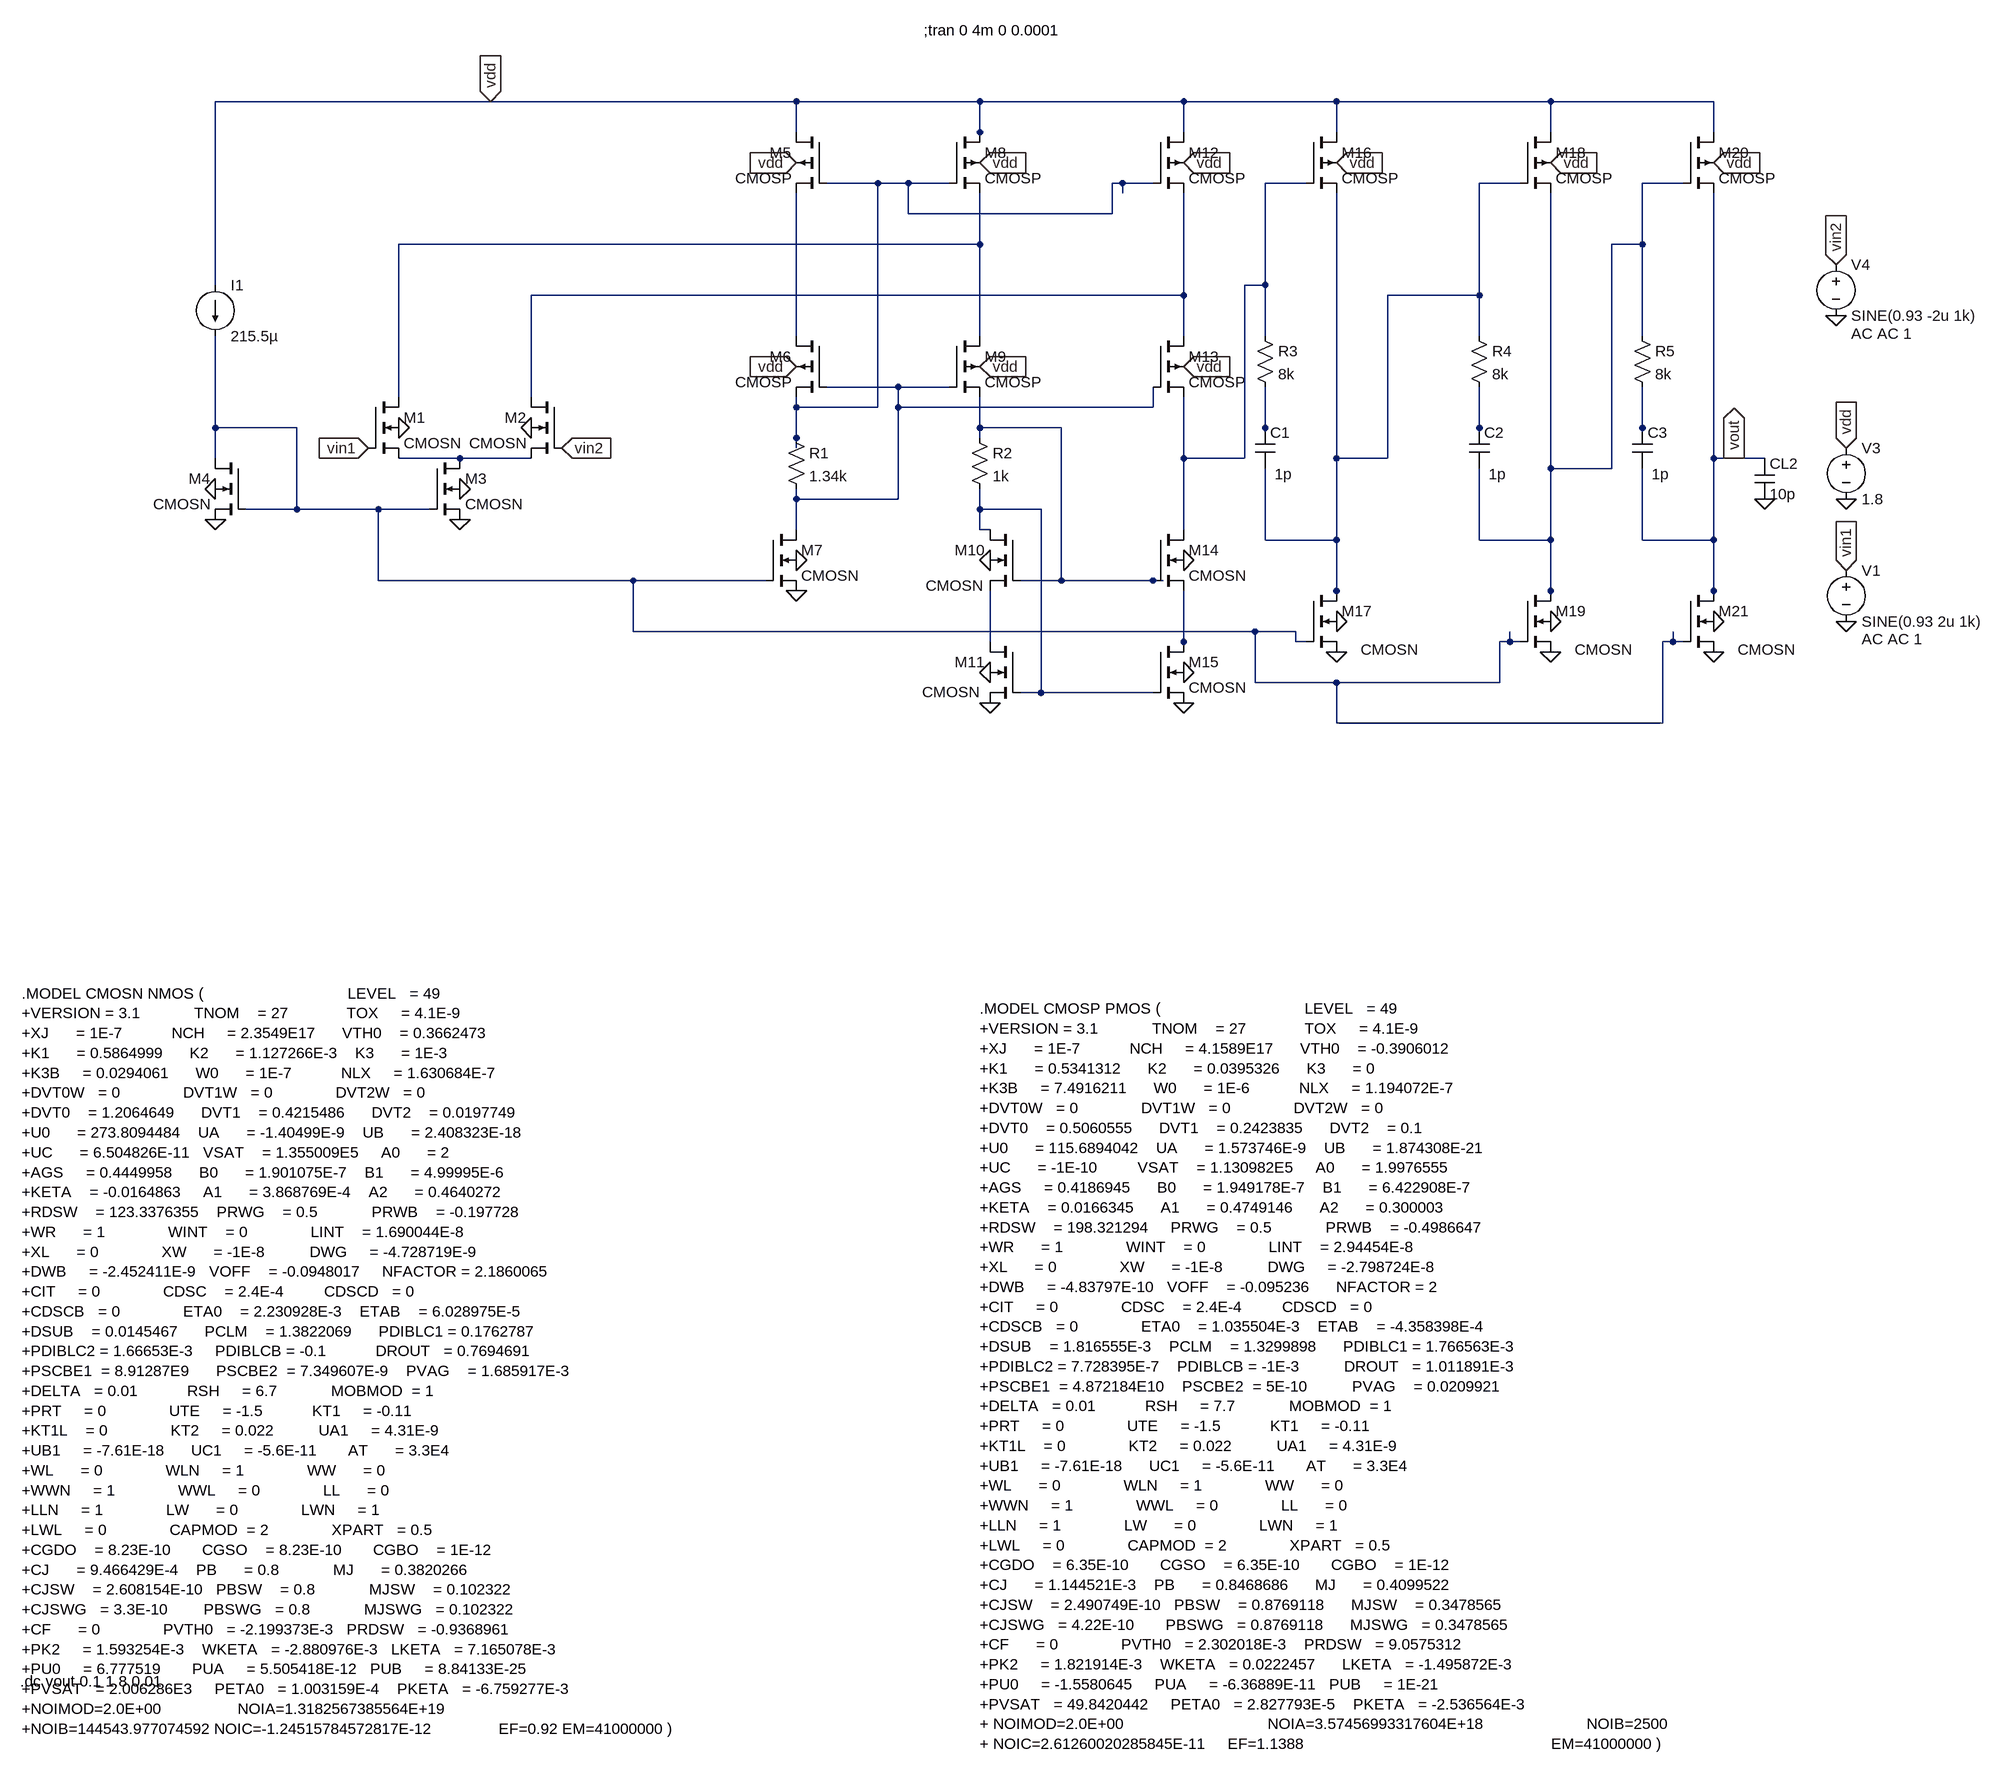
[diagram p0: schematic 4stage_fc.asc]
4stage_fc.asc, the LTspice schematic file:
Version 4
SHEET 1 1808 1648
WIRE -960 -848 -1392 -848
WIRE -480 -848 -960 -848
WIRE -192 -848 -480 -848
WIRE 128 -848 -192 -848
WIRE 368 -848 128 -848
WIRE 704 -848 368 -848
WIRE 960 -848 704 -848
WIRE -480 -800 -480 -848
WIRE -192 -800 -192 -848
WIRE 128 -800 128 -848
WIRE 368 -800 368 -848
WIRE 704 -800 704 -848
WIRE 960 -800 960 -848
WIRE -192 -784 -192 -800
WIRE -352 -720 -432 -720
WIRE -304 -720 -352 -720
WIRE -240 -720 -304 -720
WIRE 32 -720 16 -720
WIRE 80 -720 32 -720
WIRE 320 -720 256 -720
WIRE 656 -720 592 -720
WIRE 912 -720 848 -720
WIRE 32 -704 32 -720
WIRE -304 -672 -304 -720
WIRE 16 -672 16 -720
WIRE 16 -672 -304 -672
WIRE -192 -624 -192 -704
WIRE -192 -624 -1104 -624
WIRE 848 -624 848 -720
WIRE 848 -624 800 -624
WIRE -1392 -560 -1392 -848
WIRE 256 -560 256 -720
WIRE 256 -560 224 -560
WIRE 128 -544 128 -704
WIRE 128 -544 -896 -544
WIRE 592 -544 592 -720
WIRE 592 -544 448 -544
WIRE -480 -480 -480 -704
WIRE -192 -480 -192 -624
WIRE 128 -480 128 -544
WIRE 256 -480 256 -560
WIRE 592 -480 592 -544
WIRE 848 -480 848 -624
WIRE -320 -400 -432 -400
WIRE -240 -400 -320 -400
WIRE -1104 -384 -1104 -624
WIRE -896 -384 -896 -544
WIRE -480 -368 -480 -384
WIRE -352 -368 -352 -720
WIRE -352 -368 -480 -368
WIRE -320 -368 -320 -400
WIRE 80 -368 80 -400
WIRE 80 -368 -320 -368
WIRE -1392 -336 -1392 -480
WIRE -1264 -336 -1392 -336
WIRE -192 -336 -192 -384
WIRE -64 -336 -192 -336
WIRE 256 -336 256 -400
WIRE 592 -336 592 -400
WIRE 848 -336 848 -400
WIRE -480 -320 -480 -368
WIRE -192 -320 -192 -336
WIRE 256 -320 256 -336
WIRE 592 -320 592 -336
WIRE 848 -320 848 -336
WIRE -480 -304 -480 -320
WIRE -1392 -288 -1392 -336
WIRE -1008 -288 -1104 -288
WIRE -896 -288 -1008 -288
WIRE 128 -288 128 -384
WIRE 224 -288 224 -560
WIRE 224 -288 128 -288
WIRE 368 -288 368 -704
WIRE 448 -288 448 -544
WIRE 448 -288 368 -288
WIRE 960 -288 960 -704
WIRE 992 -288 960 -288
WIRE 1040 -288 992 -288
WIRE 704 -272 704 -704
WIRE 800 -272 800 -624
WIRE 800 -272 704 -272
WIRE -480 -224 -480 -240
WIRE -320 -224 -320 -368
WIRE -320 -224 -480 -224
WIRE -1264 -208 -1264 -336
WIRE -1264 -208 -1344 -208
WIRE -1136 -208 -1264 -208
WIRE -1056 -208 -1136 -208
WIRE -192 -208 -192 -240
WIRE -96 -208 -192 -208
WIRE -480 -176 -480 -224
WIRE -192 -176 -192 -208
WIRE -176 -176 -192 -176
WIRE 128 -176 128 -288
WIRE 256 -160 256 -272
WIRE 368 -160 368 -288
WIRE 368 -160 256 -160
WIRE 592 -160 592 -272
WIRE 704 -160 704 -272
WIRE 704 -160 592 -160
WIRE 848 -160 848 -272
WIRE 960 -160 960 -288
WIRE 960 -160 848 -160
WIRE -1136 -96 -1136 -208
WIRE -736 -96 -1136 -96
WIRE -528 -96 -736 -96
WIRE -64 -96 -64 -336
WIRE -64 -96 -128 -96
WIRE 80 -96 -64 -96
WIRE 96 -96 80 -96
WIRE 368 -80 368 -160
WIRE 704 -80 704 -160
WIRE 960 -80 960 -160
WIRE 368 -64 368 -80
WIRE 704 -64 704 -80
WIRE 960 -64 960 -80
WIRE -736 -16 -736 -96
WIRE 240 -16 -736 -16
WIRE 304 -16 240 -16
WIRE -176 0 -176 -80
WIRE 128 0 128 -80
WIRE 304 0 304 -16
WIRE 320 0 304 0
WIRE 640 0 640 -16
WIRE 640 0 624 0
WIRE 656 0 640 0
WIRE 896 0 896 -16
WIRE 896 0 880 0
WIRE 912 0 896 0
WIRE 128 16 128 0
WIRE 240 64 240 -16
WIRE 368 64 240 64
WIRE 624 64 624 0
WIRE 624 64 368 64
WIRE -96 80 -96 -208
WIRE -96 80 -128 80
WIRE 80 80 -96 80
WIRE 368 128 368 64
WIRE 880 128 880 0
WIRE 880 128 368 128
FLAG -1008 -192 0
FLAG -1008 -240 0
FLAG -1104 -336 0
FLAG -896 -336 0
FLAG -1152 -304 vin1
IOPIN -1152 -304 In
FLAG -848 -304 vin2
IOPIN -848 -304 In
FLAG 1168 -112 vin1
IOPIN 1168 -112 In
FLAG 1168 -32 0
FLAG 1168 -304 vdd
IOPIN 1168 -304 In
FLAG 1168 -224 0
FLAG -1392 -192 0
FLAG -1392 -240 0
FLAG -480 -752 vdd
IOPIN -480 -752 In
FLAG -480 -432 vdd
IOPIN -480 -432 In
FLAG -480 -80 0
FLAG -480 -128 0
FLAG -176 -128 0
FLAG -176 96 0
FLAG -176 48 0
FLAG -192 -432 vdd
IOPIN -192 -432 In
FLAG -192 -752 vdd
IOPIN -192 -752 In
FLAG 128 96 0
FLAG 128 48 0
FLAG 368 -32 0
FLAG 368 16 0
FLAG 128 -128 0
FLAG 128 -432 vdd
IOPIN 128 -432 In
FLAG 128 -752 vdd
IOPIN 128 -752 In
FLAG 368 -752 vdd
IOPIN 368 -752 In
FLAG -960 -848 vdd
IOPIN -960 -848 In
FLAG 704 -32 0
FLAG 704 16 0
FLAG 704 -752 vdd
IOPIN 704 -752 In
FLAG 960 -32 0
FLAG 960 16 0
FLAG 960 -752 vdd
IOPIN 960 -752 In
FLAG 1040 -224 0
FLAG 992 -288 vout
IOPIN 992 -288 Out
FLAG 1152 -512 0
FLAG 1152 -592 vin2
IOPIN 1152 -592 In
SYMBOL nmos4 -1152 -384 R0
SYMATTR InstName M1
SYMATTR Value CMOSN
SYMATTR Value2 l=0.5u w=30u
SYMBOL nmos4 -848 -384 M0
SYMATTR InstName M2
SYMATTR Value CMOSN
SYMATTR Value2 l=0.5u w=30u
SYMBOL nmos4 -1056 -288 R0
SYMATTR InstName M3
SYMATTR Value CMOSN
SYMATTR Value2 l=0.5u w=7u
SYMBOL voltage 1168 -128 R0
WINDOW 123 24 124 Left 2
WINDOW 39 0 0 Left 0
SYMATTR Value2 AC AC 1
SYMATTR InstName V1
SYMATTR Value SINE(0.93 2u 1k)
SYMBOL voltage 1168 -320 R0
WINDOW 123 0 0 Left 0
WINDOW 39 0 0 Left 0
SYMATTR InstName V3
SYMATTR Value 1.8
SYMBOL nmos4 -1344 -288 M0
SYMATTR InstName M4
SYMATTR Value CMOSN
SYMATTR Value2 l=0.5u w=7u
SYMBOL current -1392 -560 R0
WINDOW 123 0 0 Left 0
WINDOW 39 0 0 Left 0
SYMATTR InstName I1
SYMATTR Value 215.5µ
SYMBOL pmos4 -432 -800 M0
SYMATTR InstName M5
SYMATTR Value CMOSP
SYMATTR Value2 l=0.3u w=170u
SYMBOL pmos4 -432 -480 M0
SYMATTR InstName M6
SYMATTR Value CMOSP
SYMATTR Value2 l=0.3u w=170u
SYMBOL nmos4 -528 -176 R0
SYMATTR InstName M7
SYMATTR Value CMOSN
SYMATTR Value2 l=0.5u w=9u
SYMBOL res -496 -336 R0
SYMATTR InstName R1
SYMATTR Value 1.34k
SYMBOL pmos4 -240 -800 R0
SYMATTR InstName M8
SYMATTR Value CMOSP
SYMATTR Value2 l=0.3u w=170u
SYMBOL pmos4 -240 -480 R0
SYMATTR InstName M9
SYMATTR Value CMOSP
SYMATTR Value2 l=0.3u w=170u
SYMBOL res -208 -336 R0
SYMATTR InstName R2
SYMATTR Value 1k
SYMBOL nmos4 -128 -176 M0
WINDOW 3 60 88 Left 2
SYMATTR Value CMOSN
SYMATTR InstName M10
SYMATTR Value2 l=0.5u w=70u
SYMBOL nmos4 -128 0 M0
WINDOW 3 65 79 Left 2
SYMATTR Value CMOSN
SYMATTR InstName M11
SYMATTR Value2 l=0.5u w=70u
SYMBOL pmos4 80 -800 R0
SYMATTR InstName M12
SYMATTR Value CMOSP
SYMATTR Value2 l=0.3u w=170u
SYMBOL pmos4 80 -480 R0
SYMATTR InstName M13
SYMATTR Value CMOSP
SYMATTR Value2 l=0.3u w=170u
SYMBOL nmos4 80 -176 R0
SYMATTR InstName M14
SYMATTR Value CMOSN
SYMATTR Value2 l=0.5u w=70u
SYMBOL nmos4 80 0 R0
SYMATTR InstName M15
SYMATTR Value CMOSN
SYMATTR Value2 l=0.5u w=70u
SYMBOL pmos4 320 -800 R0
SYMATTR InstName M16
SYMATTR Value CMOSP
SYMATTR Value2 l=0.5u w=30u
SYMBOL nmos4 320 -80 R0
WINDOW 3 86 92 Left 2
SYMATTR Value CMOSN
SYMATTR InstName M17
SYMATTR Value2 l=0.5u w=30u
SYMBOL cap 240 -336 R0
WINDOW 3 31 73 Left 2
SYMATTR Value 1p
SYMATTR InstName C1
SYMBOL res 240 -496 R0
SYMATTR InstName R3
SYMATTR Value 8k
SYMBOL pmos4 656 -800 R0
SYMATTR InstName M18
SYMATTR Value CMOSP
SYMATTR Value2 l=0.5u w=10u
SYMBOL nmos4 656 -80 R0
WINDOW 3 86 92 Left 2
SYMATTR Value CMOSN
SYMATTR InstName M19
SYMATTR Value2 l=0.5u w=10u
SYMBOL cap 576 -336 R0
WINDOW 3 31 73 Left 2
SYMATTR Value 1p
SYMATTR InstName C2
SYMBOL res 576 -496 R0
SYMATTR InstName R4
SYMATTR Value 8k
SYMBOL pmos4 912 -800 R0
SYMATTR InstName M20
SYMATTR Value CMOSP
SYMATTR Value2 l=0.5u w=7u
SYMBOL nmos4 912 -80 R0
WINDOW 3 86 92 Left 2
SYMATTR Value CMOSN
SYMATTR InstName M21
SYMATTR Value2 l=0.5u w=7u
SYMBOL cap 832 -336 R0
WINDOW 3 31 73 Left 2
SYMATTR Value 1p
SYMATTR InstName C3
SYMBOL cap 1024 -288 R0
SYMATTR InstName CL2
SYMATTR Value 10p
SYMBOL res 832 -496 R0
SYMATTR InstName R5
SYMATTR Value 8k
SYMBOL voltage 1152 -608 R0
WINDOW 123 24 124 Left 2
WINDOW 39 0 0 Left 0
SYMATTR Value2 AC AC 1
SYMATTR InstName V4
SYMATTR Value SINE(0.93 -2u 1k)
TEXT -280 -960 Left 2 !;tran 0 4m 0 0.0001
TEXT -1696 552 Left 2 !.MODEL CMOSN NMOS (                                LEVEL   = 49\n+VERSION = 3.1            TNOM    = 27             TOX     = 4.1E-9\n+XJ      = 1E-7           NCH     = 2.3549E17      VTH0    = 0.3662473\n+K1      = 0.5864999      K2      = 1.127266E-3    K3      = 1E-3\n+K3B     = 0.0294061      W0      = 1E-7           NLX     = 1.630684E-7\n+DVT0W   = 0              DVT1W   = 0              DVT2W   = 0\n+DVT0    = 1.2064649      DVT1    = 0.4215486      DVT2    = 0.0197749\n+U0      = 273.8094484    UA      = -1.40499E-9    UB      = 2.408323E-18\n+UC      = 6.504826E-11   VSAT    = 1.355009E5     A0      = 2\n+AGS     = 0.4449958      B0      = 1.901075E-7    B1      = 4.99995E-6\n+KETA    = -0.0164863     A1      = 3.868769E-4    A2      = 0.4640272\n+RDSW    = 123.3376355    PRWG    = 0.5            PRWB    = -0.197728\n+WR      = 1              WINT    = 0              LINT    = 1.690044E-8\n+XL      = 0              XW      = -1E-8          DWG     = -4.728719E-9\n+DWB     = -2.452411E-9   VOFF    = -0.0948017     NFACTOR = 2.1860065\n+CIT     = 0              CDSC    = 2.4E-4         CDSCD   = 0\n+CDSCB   = 0              ETA0    = 2.230928E-3    ETAB    = 6.028975E-5\n+DSUB    = 0.0145467      PCLM    = 1.3822069      PDIBLC1 = 0.1762787\n+PDIBLC2 = 1.66653E-3     PDIBLCB = -0.1           DROUT   = 0.7694691\n+PSCBE1  = 8.91287E9      PSCBE2  = 7.349607E-9    PVAG    = 1.685917E-3\n+DELTA   = 0.01           RSH     = 6.7            MOBMOD  = 1\n+PRT     = 0              UTE     = -1.5           KT1     = -0.11\n+KT1L    = 0              KT2     = 0.022          UA1     = 4.31E-9\n+UB1     = -7.61E-18      UC1     = -5.6E-11       AT      = 3.3E4\n+WL      = 0              WLN     = 1              WW      = 0\n+WWN     = 1              WWL     = 0              LL      = 0\n+LLN     = 1              LW      = 0              LWN     = 1\n+LWL     = 0              CAPMOD  = 2              XPART   = 0.5\n+CGDO    = 8.23E-10       CGSO    = 8.23E-10       CGBO    = 1E-12\n+CJ      = 9.466429E-4    PB      = 0.8            MJ      = 0.3820266\n+CJSW    = 2.608154E-10   PBSW    = 0.8            MJSW    = 0.102322\n+CJSWG   = 3.3E-10        PBSWG   = 0.8            MJSWG   = 0.102322\n+CF      = 0              PVTH0   = -2.199373E-3   PRDSW   = -0.9368961\n+PK2     = 1.593254E-3    WKETA   = -2.880976E-3   LKETA   = 7.165078E-3\n+PU0     = 6.777519       PUA     = 5.505418E-12   PUB     = 8.84133E-25\n+PVSAT   = 2.006286E3     PETA0   = 1.003159E-4    PKETA   = -6.759277E-3\n+NOIMOD=2.0E+00                 NOIA=1.3182567385564E+19\n+NOIB=144543.977074592 NOIC=-1.24515784572817E-12               EF=0.92 EM=41000000 )
TEXT -192 576 Left 2 !.MODEL CMOSP PMOS (                                LEVEL   = 49\n+VERSION = 3.1            TNOM    = 27             TOX     = 4.1E-9\n+XJ      = 1E-7           NCH     = 4.1589E17      VTH0    = -0.3906012\n+K1      = 0.5341312      K2      = 0.0395326      K3      = 0\n+K3B     = 7.4916211      W0      = 1E-6           NLX     = 1.194072E-7\n+DVT0W   = 0              DVT1W   = 0              DVT2W   = 0\n+DVT0    = 0.5060555      DVT1    = 0.2423835      DVT2    = 0.1\n+U0      = 115.6894042    UA      = 1.573746E-9    UB      = 1.874308E-21\n+UC      = -1E-10         VSAT    = 1.130982E5     A0      = 1.9976555\n+AGS     = 0.4186945      B0      = 1.949178E-7    B1      = 6.422908E-7\n+KETA    = 0.0166345      A1      = 0.4749146      A2      = 0.300003\n+RDSW    = 198.321294     PRWG    = 0.5            PRWB    = -0.4986647\n+WR      = 1              WINT    = 0              LINT    = 2.94454E-8\n+XL      = 0              XW      = -1E-8          DWG     = -2.798724E-8\n+DWB     = -4.83797E-10   VOFF    = -0.095236      NFACTOR = 2\n+CIT     = 0              CDSC    = 2.4E-4         CDSCD   = 0\n+CDSCB   = 0              ETA0    = 1.035504E-3    ETAB    = -4.358398E-4\n+DSUB    = 1.816555E-3    PCLM    = 1.3299898      PDIBLC1 = 1.766563E-3\n+PDIBLC2 = 7.728395E-7    PDIBLCB = -1E-3          DROUT   = 1.011891E-3\n+PSCBE1  = 4.872184E10    PSCBE2  = 5E-10          PVAG    = 0.0209921\n+DELTA   = 0.01           RSH     = 7.7            MOBMOD  = 1\n+PRT     = 0              UTE     = -1.5           KT1     = -0.11\n+KT1L    = 0              KT2     = 0.022          UA1     = 4.31E-9\n+UB1     = -7.61E-18      UC1     = -5.6E-11       AT      = 3.3E4\n+WL      = 0              WLN     = 1              WW      = 0\n+WWN     = 1              WWL     = 0              LL      = 0\n+LLN     = 1              LW      = 0              LWN     = 1\n+LWL     = 0              CAPMOD  = 2              XPART   = 0.5\n+CGDO    = 6.35E-10       CGSO    = 6.35E-10       CGBO    = 1E-12\n+CJ      = 1.144521E-3    PB      = 0.8468686      MJ      = 0.4099522\n+CJSW    = 2.490749E-10   PBSW    = 0.8769118      MJSW    = 0.3478565\n+CJSWG   = 4.22E-10       PBSWG   = 0.8769118      MJSWG   = 0.3478565\n+CF      = 0              PVTH0   = 2.302018E-3    PRDSW   = 9.0575312\n+PK2     = 1.821914E-3    WKETA   = 0.0222457      LKETA   = -1.495872E-3\n+PU0     = -1.5580645     PUA     = -6.36889E-11   PUB     = 1E-21\n+PVSAT   = 49.8420442     PETA0   = 2.827793E-5    PKETA   = -2.536564E-3 \n+ NOIMOD=2.0E+00                                NOIA=3.57456993317604E+18                       NOIB=2500\n+ NOIC=2.61260020285845E-11     EF=1.1388                                                       EM=41000000 )
TEXT -1698 1632 Left 2 !.dc vout 0.1 1.8 0.01

The netlist it stands for:
* 4stage_fc.asc
M1 N005 vin1 N014 0 CMOSN l=0.5u w=30u
M2 N006 vin2 N014 0 CMOSN l=0.5u w=30u
M3 N014 N009 0 0 CMOSN l=0.5u w=7u
V1 vin1 0 SINE(0.93 2u 1k) AC AC 1
V3 vdd 0 1.8
M4 N009 N009 0 0 CMOSN l=0.5u w=7u
I1 vdd N009 215.5µ
M5 vdd N001 N007 vdd CMOSP l=0.3u w=170u
M6 N007 N008 N001 vdd CMOSP l=0.3u w=170u
M7 N008 N009 0 0 CMOSN l=0.5u w=9u
R1 N001 N008 1.34k
M8 vdd N001 N005 vdd CMOSP l=0.3u w=170u
M9 N005 N008 N010 vdd CMOSP l=0.3u w=170u
R2 N010 N015 1k
M10 N015 N010 N016 0 CMOSN l=0.5u w=70u
M11 N016 N015 0 0 CMOSN l=0.5u w=70u
M12 vdd N001 N006 vdd CMOSP l=0.3u w=170u
M13 N006 N008 N002 vdd CMOSP l=0.3u w=170u
M14 N002 N010 N017 0 CMOSN l=0.5u w=70u
M15 N017 N015 0 0 CMOSN l=0.5u w=70u
M16 vdd N002 N003 vdd CMOSP l=0.5u w=30u
M17 N003 N009 0 0 CMOSN l=0.5u w=30u
C1 N011 N003 1p
R3 N002 N011 8k
M18 vdd N003 N004 vdd CMOSP l=0.5u w=10u
M19 N004 N009 0 0 CMOSN l=0.5u w=10u
C2 N012 N004 1p
R4 N003 N012 8k
M20 vdd N004 vout vdd CMOSP l=0.5u w=7u
M21 vout N009 0 0 CMOSN l=0.5u w=7u
C3 N013 vout 1p
CL2 vout 0 10p
R5 N004 N013 8k
V4 vin2 0 SINE(0.93 -2u 1k) AC AC 1
.model NMOS NMOS
.model PMOS PMOS
.lib standard.mos
;tran 0 4m 0 0.0001
.MODEL CMOSN NMOS (                                LEVEL   = 49
+VERSION = 3.1            TNOM    = 27             TOX     = 4.1E-9
+XJ      = 1E-7           NCH     = 2.3549E17      VTH0    = 0.3662473
+K1      = 0.5864999      K2      = 1.127266E-3    K3      = 1E-3
+K3B     = 0.0294061      W0      = 1E-7           NLX     = 1.630684E-7
+DVT0W   = 0              DVT1W   = 0              DVT2W   = 0
+DVT0    = 1.2064649      DVT1    = 0.4215486      DVT2    = 0.0197749
+U0      = 273.8094484    UA      = -1.40499E-9    UB      = 2.408323E-18
+UC      = 6.504826E-11   VSAT    = 1.355009E5     A0      = 2
+AGS     = 0.4449958      B0      = 1.901075E-7    B1      = 4.99995E-6
+KETA    = -0.0164863     A1      = 3.868769E-4    A2      = 0.4640272
+RDSW    = 123.3376355    PRWG    = 0.5            PRWB    = -0.197728
+WR      = 1              WINT    = 0              LINT    = 1.690044E-8
+XL      = 0              XW      = -1E-8          DWG     = -4.728719E-9
+DWB     = -2.452411E-9   VOFF    = -0.0948017     NFACTOR = 2.1860065
+CIT     = 0              CDSC    = 2.4E-4         CDSCD   = 0
+CDSCB   = 0              ETA0    = 2.230928E-3    ETAB    = 6.028975E-5
+DSUB    = 0.0145467      PCLM    = 1.3822069      PDIBLC1 = 0.1762787
+PDIBLC2 = 1.66653E-3     PDIBLCB = -0.1           DROUT   = 0.7694691
+PSCBE1  = 8.91287E9      PSCBE2  = 7.349607E-9    PVAG    = 1.685917E-3
+DELTA   = 0.01           RSH     = 6.7            MOBMOD  = 1
+PRT     = 0              UTE     = -1.5           KT1     = -0.11
+KT1L    = 0              KT2     = 0.022          UA1     = 4.31E-9
+UB1     = -7.61E-18      UC1     = -5.6E-11       AT      = 3.3E4
+WL      = 0              WLN     = 1              WW      = 0
+WWN     = 1              WWL     = 0              LL      = 0
+LLN     = 1              LW      = 0              LWN     = 1
+LWL     = 0              CAPMOD  = 2              XPART   = 0.5
+CGDO    = 8.23E-10       CGSO    = 8.23E-10       CGBO    = 1E-12
+CJ      = 9.466429E-4    PB      = 0.8            MJ      = 0.3820266
+CJSW    = 2.608154E-10   PBSW    = 0.8            MJSW    = 0.102322
+CJSWG   = 3.3E-10        PBSWG   = 0.8            MJSWG   = 0.102322
+CF      = 0              PVTH0   = -2.199373E-3   PRDSW   = -0.9368961
+PK2     = 1.593254E-3    WKETA   = -2.880976E-3   LKETA   = 7.165078E-3
+PU0     = 6.777519       PUA     = 5.505418E-12   PUB     = 8.84133E-25
+PVSAT   = 2.006286E3     PETA0   = 1.003159E-4    PKETA   = -6.759277E-3
+NOIMOD=2.0E+00                 NOIA=1.3182567385564E+19
+NOIB=144543.977074592 NOIC=-1.24515784572817E-12               EF=0.92 EM=41000000 )
.MODEL CMOSP PMOS (                                LEVEL   = 49
+VERSION = 3.1            TNOM    = 27             TOX     = 4.1E-9
+XJ      = 1E-7           NCH     = 4.1589E17      VTH0    = -0.3906012
+K1      = 0.5341312      K2      = 0.0395326      K3      = 0
+K3B     = 7.4916211      W0      = 1E-6           NLX     = 1.194072E-7
+DVT0W   = 0              DVT1W   = 0              DVT2W   = 0
+DVT0    = 0.5060555      DVT1    = 0.2423835      DVT2    = 0.1
+U0      = 115.6894042    UA      = 1.573746E-9    UB      = 1.874308E-21
+UC      = -1E-10         VSAT    = 1.130982E5     A0      = 1.9976555
+AGS     = 0.4186945      B0      = 1.949178E-7    B1      = 6.422908E-7
+KETA    = 0.0166345      A1      = 0.4749146      A2      = 0.300003
+RDSW    = 198.321294     PRWG    = 0.5            PRWB    = -0.4986647
+WR      = 1              WINT    = 0              LINT    = 2.94454E-8
+XL      = 0              XW      = -1E-8          DWG     = -2.798724E-8
+DWB     = -4.83797E-10   VOFF    = -0.095236      NFACTOR = 2
+CIT     = 0              CDSC    = 2.4E-4         CDSCD   = 0
+CDSCB   = 0              ETA0    = 1.035504E-3    ETAB    = -4.358398E-4
+DSUB    = 1.816555E-3    PCLM    = 1.3299898      PDIBLC1 = 1.766563E-3
+PDIBLC2 = 7.728395E-7    PDIBLCB = -1E-3          DROUT   = 1.011891E-3
+PSCBE1  = 4.872184E10    PSCBE2  = 5E-10          PVAG    = 0.0209921
+DELTA   = 0.01           RSH     = 7.7            MOBMOD  = 1
+PRT     = 0              UTE     = -1.5           KT1     = -0.11
+KT1L    = 0              KT2     = 0.022          UA1     = 4.31E-9
+UB1     = -7.61E-18      UC1     = -5.6E-11       AT      = 3.3E4
+WL      = 0              WLN     = 1              WW      = 0
+WWN     = 1              WWL     = 0              LL      = 0
+LLN     = 1              LW      = 0              LWN     = 1
+LWL     = 0              CAPMOD  = 2              XPART   = 0.5
+CGDO    = 6.35E-10       CGSO    = 6.35E-10       CGBO    = 1E-12
+CJ      = 1.144521E-3    PB      = 0.8468686      MJ      = 0.4099522
+CJSW    = 2.490749E-10   PBSW    = 0.8769118      MJSW    = 0.3478565
+CJSWG   = 4.22E-10       PBSWG   = 0.8769118      MJSWG   = 0.3478565
+CF      = 0              PVTH0   = 2.302018E-3    PRDSW   = 9.0575312
+PK2     = 1.821914E-3    WKETA   = 0.0222457      LKETA   = -1.495872E-3
+PU0     = -1.5580645     PUA     = -6.36889E-11   PUB     = 1E-21
+PVSAT   = 49.8420442     PETA0   = 2.827793E-5    PKETA   = -2.536564E-3
+ NOIMOD=2.0E+00                                NOIA=3.57456993317604E+18                       NOIB=2500
+ NOIC=2.61260020285845E-11     EF=1.1388                                                       EM=41000000 )
.dc vout 0.1 1.8 0.01
.backanno
.end